# EAGLE schematic intellivalve_r1 (EAGLE 9.6.2)
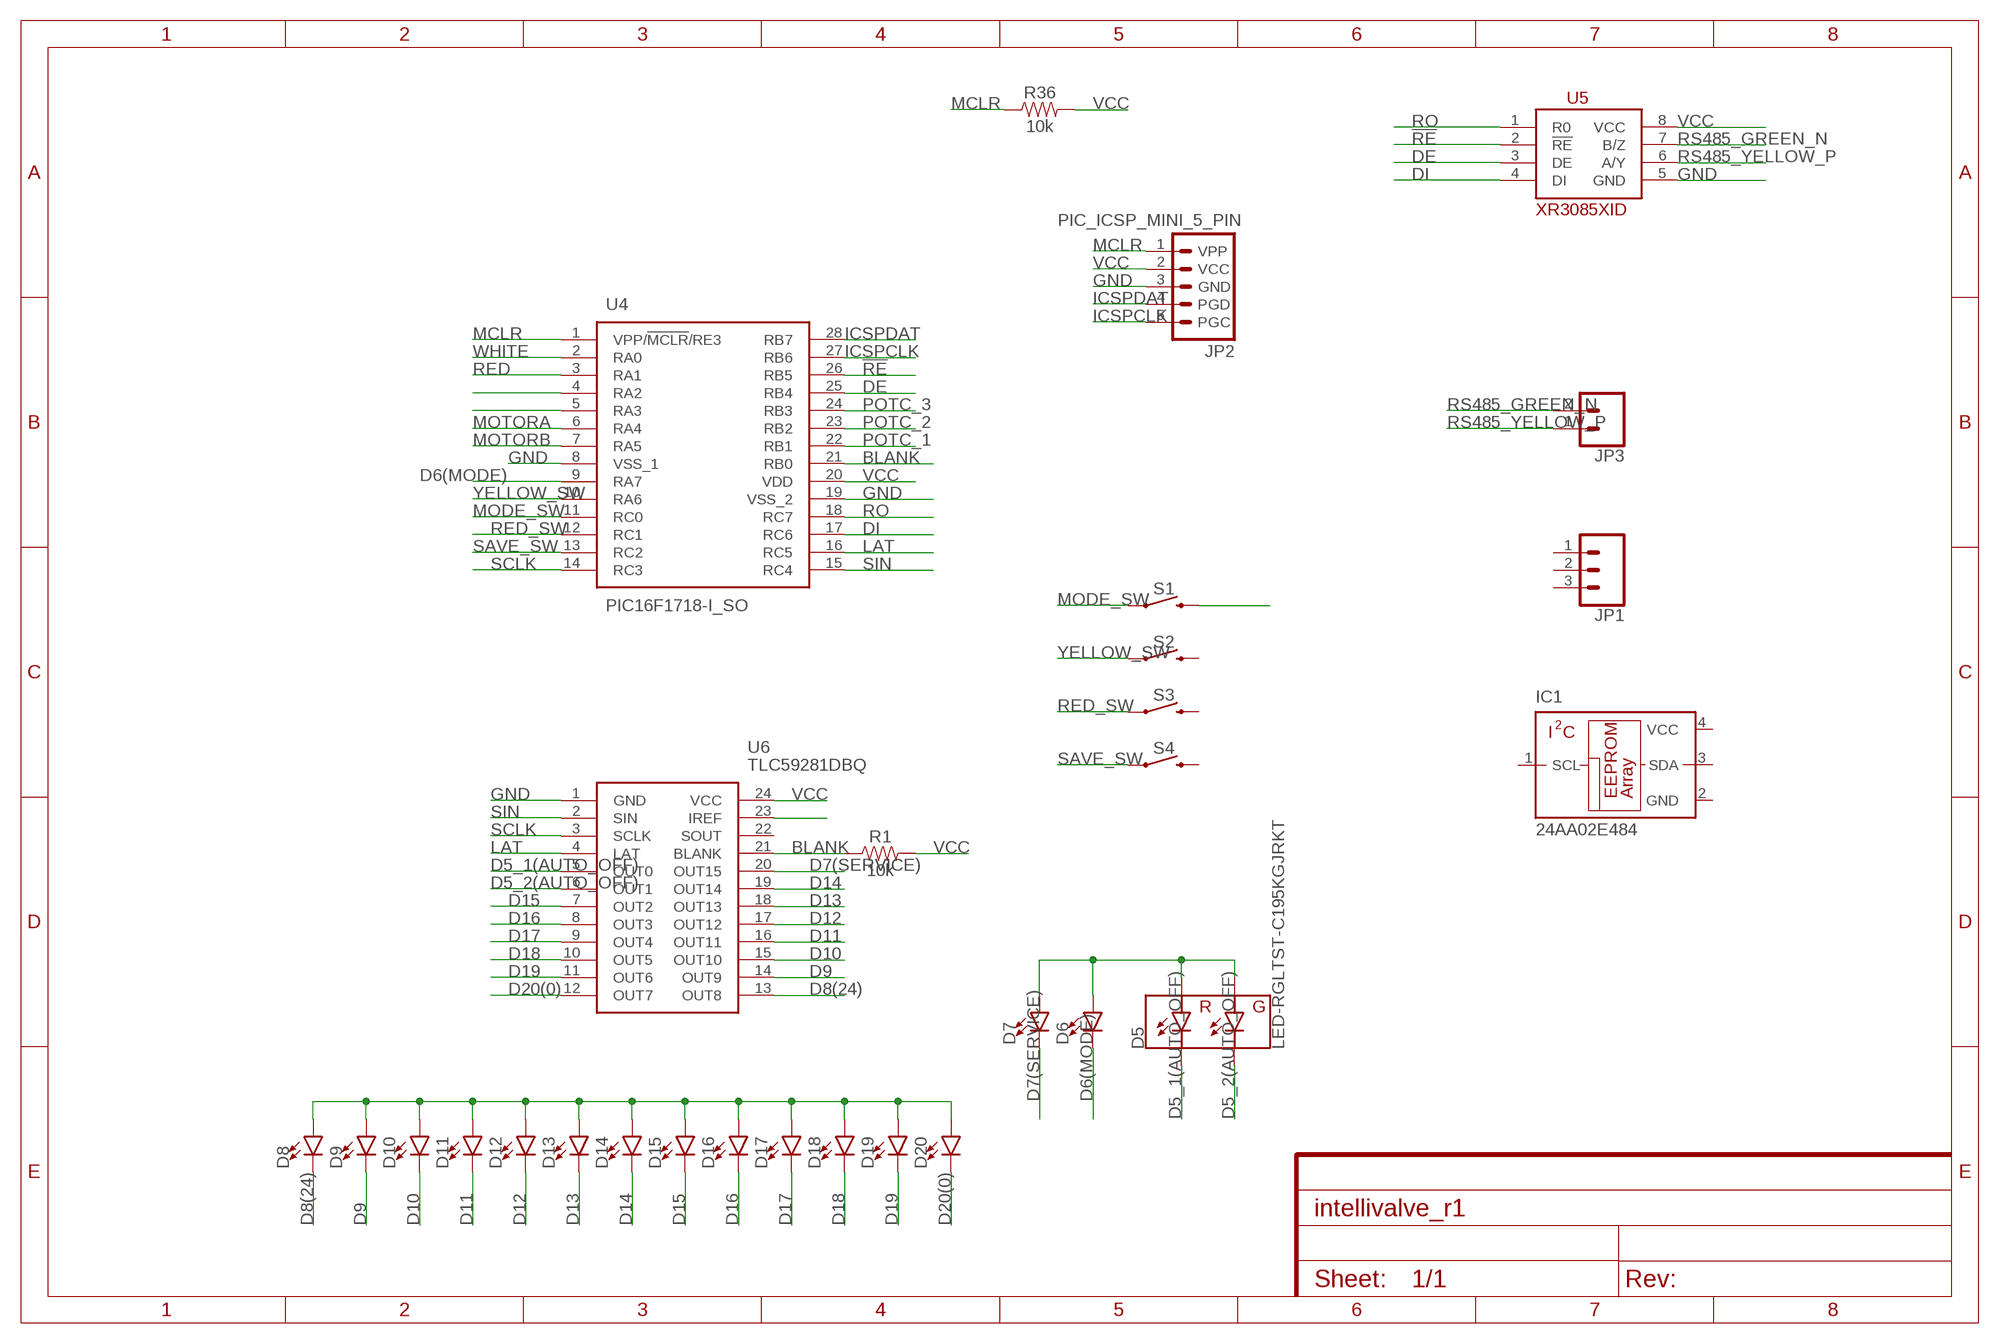
[diagram p0: schematic, sheet 1]

## Parts
D5  LED-RGLTST-C195KGJRKT  [LTST-C195KGJRKT]
D6  LED0603  [LED-0603]
D7  LED0603  [LED-0603]
D8  LED0603  [LED-0603]
D9  LED0603  [LED-0603]
D10  LED0603  [LED-0603]
D11  LED0603  [LED-0603]
D12  LED0603  [LED-0603]
D13  LED0603  [LED-0603]
D14  LED0603  [LED-0603]
D15  LED0603  [LED-0603]
D16  LED0603  [LED-0603]
D17  LED0603  [LED-0603]
D18  LED0603  [LED-0603]
D19  LED0603  [LED-0603]
D20  LED0603  [LED-0603]
IC1  24AA02E484  24AA00OT  [SOT23-5L]
JP1  CONN_03SMD  [1X03-1MM-RA]
JP2  PIC_ICSP_MINI_5_PIN  [PIC_ICSP_MINI_5_PIN]
JP3  CONN_02-JST-2MM-SMT  [JST-2-SMD]
R1  10k  RESISTOR0402  [0402]
R36  10k  RESISTOR0402  [0402]
S1  MOMENTARY-SWITCH-SPST-SMD-4.5MM  [TACTILE_SWITCH_SMD_4.5MM]
S2  MOMENTARY-SWITCH-SPST-SMD-4.5MM  [TACTILE_SWITCH_SMD_4.5MM]
S3  MOMENTARY-SWITCH-SPST-SMD-4.5MM  [TACTILE_SWITCH_SMD_4.5MM]
S4  MOMENTARY-SWITCH-SPST-SMD-4.5MM  [TACTILE_SWITCH_SMD_4.5MM]
U4  PIC16F1718-I_SO  [SOIC127P1030X265-28N]
U5  XR3085XID  [BADSOIC-8]
U6  TLC59281DBQ  [SOP64P600X175-24N]

## Nets
!RE!: U4.26(RB5) U5.2(!RE!)
BLANK: R1.1 U4.21(RB0) U6.21(BLANK)
D5_1(AUTO_OFF): D5.P$4(RC) U6.5(OUT0)
D5_2(AUTO_OFF): D5.P$3(GC) U6.6(OUT1)
D6(MODE): D6.C U4.9(RA7)
D7(SERVICE): D7.C U6.20(OUT15)
D8(24): D8.C U6.13(OUT8)
D9: D9.C U6.14(OUT9)
D10: D10.C U6.15(OUT10)
D11: D11.C U6.16(OUT11)
D12: D12.C U6.17(OUT12)
D13: D13.C U6.18(OUT13)
D14: D14.C U6.19(OUT14)
D15: D15.C U6.7(OUT2)
D16: D16.C U6.8(OUT3)
D17: D17.C U6.9(OUT4)
D18: D18.C U6.10(OUT5)
D19: D19.C U6.11(OUT6)
D20(0): D20.C U6.12(OUT7)
DE: U4.25(RB4) U5.3(DE)
DI: U4.17(RC6) U5.4(DI)
GND: JP2.3(GND) U4.8(VSS_1) U4.19(VSS_2) U5.5(GND) U6.1(GND)
ICSPCLK: JP2.5(PGC) U4.27(RB6)
ICSPDAT: JP2.4(PGD) U4.28(RB7)
LAT: U4.16(RC5) U6.4(LAT)
MCLR: JP2.1(VPP) R36.1 U4.1(VPP/!MCLR!/RE3)
MODE_SW: S1.2 S1.3 U4.11(RC0)
MOTORA: U4.6(RA4)
MOTORB: U4.7(RA5)
N$1: D8.A D9.A D10.A D11.A D12.A D13.A D14.A D15.A D16.A D17.A D18.A D19.A D20.A
N$4: S1.1 S1.4
N$9: D5.P$1(GA) D5.P$2(RA) D6.A D7.A
N$13: U4.5(RA3)
N$14: U4.4(RA2)
N$25: U6.23(IREF)
POTC_1: U4.22(RB1)
POTC_2: U4.23(RB2)
POTC_3: U4.24(RB3)
RED: U4.3(RA1)
RED_SW: S3.2 S3.3 U4.12(RC1)
RO: U4.18(RC7) U5.1(R0)
RS485_GREEN_N: JP3.2 U5.7(B/Z)
RS485_YELLOW_P: JP3.1 U5.6(A/Y)
SAVE_SW: S4.2 S4.3 U4.13(RC2)
SCLK: U4.14(RC3) U6.3(SCLK)
SIN: U4.15(RC4) U6.2(SIN)
VCC: JP2.2(VCC) R1.2 R36.2 U4.20(VDD) U5.8(VCC) U6.24(VCC)
WHITE: U4.2(RA0)
YELLOW_SW: S2.2 S2.3 U4.10(RA6)
Unconnected: IC1.1(SCL) IC1.3(SDA) JP1.1 JP1.2 JP1.3 S2.1 S2.4 S3.1 S3.4 S4.1 S4.4 U6.22(SOUT)

## Power pins joined to a net without a drawn wire
GND: IC1.2(GND)
VCC: IC1.4(VCC)

## Library data of the parts
D5 = SparkFun-LED:LED-RG: LiteOn Technology Corporation LTST-C195KGJRKT - LED GREEN/RED CLEAR 0606 SMD Color: Red/Green Lens Transparency: Clear Lens Style/Size: Rectangle with Flat top, 1.10 x 1.5 mm mC Rating45mcd Red, 35 mcd Green Current: 20mA Red, 20mA Green Forward Voltage: 2V Red, 2V Green Packages: 0606 SparkFun Products: Electric Imp imp002 Breakout <[https://www.sparkfun.com/products/12958]>; PROD_ID: DIO-12140
D6-D20 = SparkFun-LED:LED: LED (Generic) Standard schematic elements and footprints for 5mm, 3mm, 1206, and 0603 sized LEDs. Generic LEDs with no color specified.
IC1 = microchip:24*00: Serial EEPROM 128 bit, I2C (AA = 1.8 V/LC = 2.5 V/C = 5.0 V); MF: MICROCHIP; MPN: 24AA00T-I/OTG; OC_FARNELL: 1331264; OC_NEWARK: 89H3038
JP1 = SparkFun-Connectors:CONN_03: Multi connection point. Often used as Generic Header-pin footprint for 0.1 inch spaced/style header connections On any of the 0.1 inch spaced packages, you can populate with these: Break Away Headers - Straight <https://www.sparkfun.com/products/116> (PRT-00116) Break Away Male Headers - Right Angle <https://www.sparkfun.com/products/553> (PRT-00553) Female Headers <https://www.sparkfun.com/products/115> (PRT-00115) Break Away Headers - Machine Pin <https://www.sparkfun.com/products/117> (PRT-00117) Break Away Female Headers - Swiss Machine Pin <https://www.sparkfun.com/products/743> (PRT-00743) Stackable Header - 3 Pin (Female, 0.1") <https://www.sparkfun.com/products/13875> (PRT-13875) For SCREWTERMINALS and SPRING TERMINALS visit here: Screw Terimnals on SparkFun.com <https://www.sparkfun.com/search/results?term=Screw+Terminals> (5mm/3.5mm/2.54mm spacing) This device is also useful as a general connection point to wire up your design to another part of your project. Our various solder wires solder well into these plated through hole pads. Hook-Up Wire - Assortment (Stranded, 22 AWG) <https://www.sparkfun.com/products/11375> (PRT-11375) Hook-Up Wire - Assortment (Solid Core, 22 AWG) <https://www.sparkfun.com/products/11367> (PRT-11367) View the entire wire category on our website here <https://www.sparkfun.com/categories/141> Special notes: Molex polarized connector foot print use with SKU : PRT-08232 with associated crimp pins and housings.
JP2 = SparkFun-Connectors:PIC_ICSP_MINI_5_PIN: PIC-ICSP-Mini Miniature 5-pin connection for temporary programming of PICs. Use this device in your design to save space. Miniature ISCP Programming connector for PICs This 5 pin header contains all the lines necessary for programming most PIC microcontrollers. Use this device in your design to save space. Here is the connector we sell at SparkFun: 5-Pin Mini ICSP Connector <https://www.sparkfun.com/products/11264> (PRT-11264) It is used on these SparkFun products: USB Bit Whacker - 18F2553 Development Board <https://www.sparkfun.com/products/762> (DEV-00762) SparkFun Serial Enabled LCD Backpack <https://www.sparkfun.com/products/258> (LCD-00258) Also, if you need a nice PIC programmer, please check these out: MPLAB PICkit 3 <https://www.sparkfun.com/products/9973> (PGM-09973); PROD_ID: CONN-08314; SF_ID: PRT-11264
JP3 = SparkFun-Connectors:CONN_02: Multi connection point. Often used as Generic Header-pin footprint for 0.1 inch spaced/style header connections On any of the 0.1 inch spaced packages, you can populate with these: Break Away Headers - Straight <https://www.sparkfun.com/products/116> (PRT-00116) Break Away Male Headers - Right Angle <https://www.sparkfun.com/products/553> (PRT-00553) Female Headers <https://www.sparkfun.com/products/115> (PRT-00115) Break Away Headers - Machine Pin <https://www.sparkfun.com/products/117> (PRT-00117) Break Away Female Headers - Swiss Machine Pin <https://www.sparkfun.com/products/743> (PRT-00743) For SCREWTERMINALS and SPRING TERMINALS visit here: Screw Terimnals on SparkFun.com <https://www.sparkfun.com/search/results?term=Screw+Terminals> (5mm/3.5mm/2.54mm spacing) This device is also useful as a general connection point to wire up your design to another part of your project. Our various solder wires solder well into these plated through hole pads. Hook-Up Wire - Assortment (Stranded, 22 AWG) <https://www.sparkfun.com/products/11375> (PRT-11375) Hook-Up Wire - Assortment (Solid Core, 22 AWG) <https://www.sparkfun.com/products/11367> (PRT-11367) View the entire wire category on our website here <https://www.sparkfun.com/categories/141> Special notes: Molex polarized connector foot print use with: PRT-08233 with associated crimp pins and housings. 2.54_SCREWTERM for use with PRT-10571. 3.5mm Screw Terminal footprints for PRT-08084 5mm Screw Terminal footprints for use with PRT-08432; PROD_ID: CONN-11443
R1 R36 = SparkFun-Resistors:RESISTOR: Generic Resistor Package
S1-S4 = SparkFun-Switches:MOMENTARY-SWITCH-SPST: Momentary Switch (Pushbutton) - SPST Normally-open (NO) SPST momentary switches (buttons, pushbuttons). Variants PTH-12MM - 12mm square, through-hole Momentary Pushbutton Switch - 12mm Square <https://www.sparkfun.com/products/9190> (COM-09190) PTH-6.0MM, PTH-6.0MM-KIT - 6.0mm square, through-hole Mini Pushbutton Switch <https://www.sparkfun.com/products/97> (COM-00097) KIT package intended for soldering kit's - only one side of pads' copper is exposed. PTH-RIGHT-ANGLE-KIT - Right-angle, through-hole Right Angle Tactile Button <https://www.sparkfun.com/products/10791> - Used on SparkFun BigTime Watch Kit <https://www.sparkfun.com/products/11734> SMD-12MM - 12mm square, surface-mount Tactile Button - SMD (12mm) <https://www.sparkfun.com/products/12993> (COM-12993) Used on SparkFun PicoBoard <https://www.sparkfun.com/products/11888> SMD-4.5MM - 4.5mm Square Trackball Switch Used on SparkFun Blackberry Trackballer Breakout <https://www.sparkfun.com/products/13169> SMD-4.6MMX2.8MM - 4.60mm x 2.80mm, surface mount Used on SparkFun SAMD21 Mini Breakout <https://www.sparkfun.com/products/13664> SMD-5.2MM, SMD-5.2-REDUNDANT - 5.2mm square, surface-mount Mini Pushbutton Switch - SMD <https://www.sparkfun.com/products/8720> (COM-08720) Used on Arduino Pro Mini <https://www.sparkfun.com/products/11114> REDUNDANT package connects both switch circuits together SMD-6.0X3.5MM - 6.0 x 3.5mm, surface mount Momentary Reset Switch SMD <https://www.sparkfun.com/products/8229> (COM-08229) SMD-6.2MM-TALL - 6.2mm square, surface mount Tactile Button - SMD (6mm) <https://www.sparkfun.com/products/12992> Used on SparkFun Digital Sandbox <https://www.sparkfun.com/products/12651> SMD-RIGHT-ANGLE - Right-angle, surface mount Used on SparkFun Block for Intel® Edison - Arduino <https://www.sparkfun.com/products/13036>; PROD_ID: SWCH-09213
U4 = SamacSys_Parts:PIC16F1718-I_SO: Microchip Technology PIC16F1718-I/SO, 8bit 8 bit CPU Microcontroller, 32MHz, 28 kB Flash, 28-Pin SOIC Source: Datasheet <https://www.arrow.com/en/products/pic16f1718-iso/microchip-technology>; DESCRIPTION: Microchip Technology PIC16F1718-I/SO, 8bit 8 bit CPU Microcontroller, 32MHz, 28 kB Flash, 28-Pin SOIC; HEIGHT: 2.65mm; MANUFACTURER_NAME: Microchip; MANUFACTURER_PART_NUMBER: PIC16F1718-I/SO; MOUSER_PART_NUMBER: 579-PIC16F1718-I/SO; MOUSER_PRICE-STOCK: https://www.mouser.co.uk/ProductDetail/Microchip-Technology/PIC16F1718-I-SO?qs=PQDAUpz3sUOn5GSmEr0F%2FA%3D%3D
U5 = Jeff:XR3085XID
U6 = SamacSys_Parts:TLC59281DBQ: 16-Channel, Constant-Current LED Driver without LED Open Detection Source: Datasheet <http://www.ti.com/lit/gpn/TLC59281>; DESCRIPTION: 16-Channel, Constant-Current LED Driver without LED Open Detection; HEIGHT: 1.75mm; MANUFACTURER_NAME: Texas Instruments; MANUFACTURER_PART_NUMBER: TLC59281DBQ; MOUSER_PART_NUMBER: 595-TLC59281DBQ; MOUSER_PRICE-STOCK: https://www.mouser.co.uk/ProductDetail/Texas-Instruments/TLC59281DBQ?qs=yoyprvkDL1kkJf0rCz1krw%3D%3D